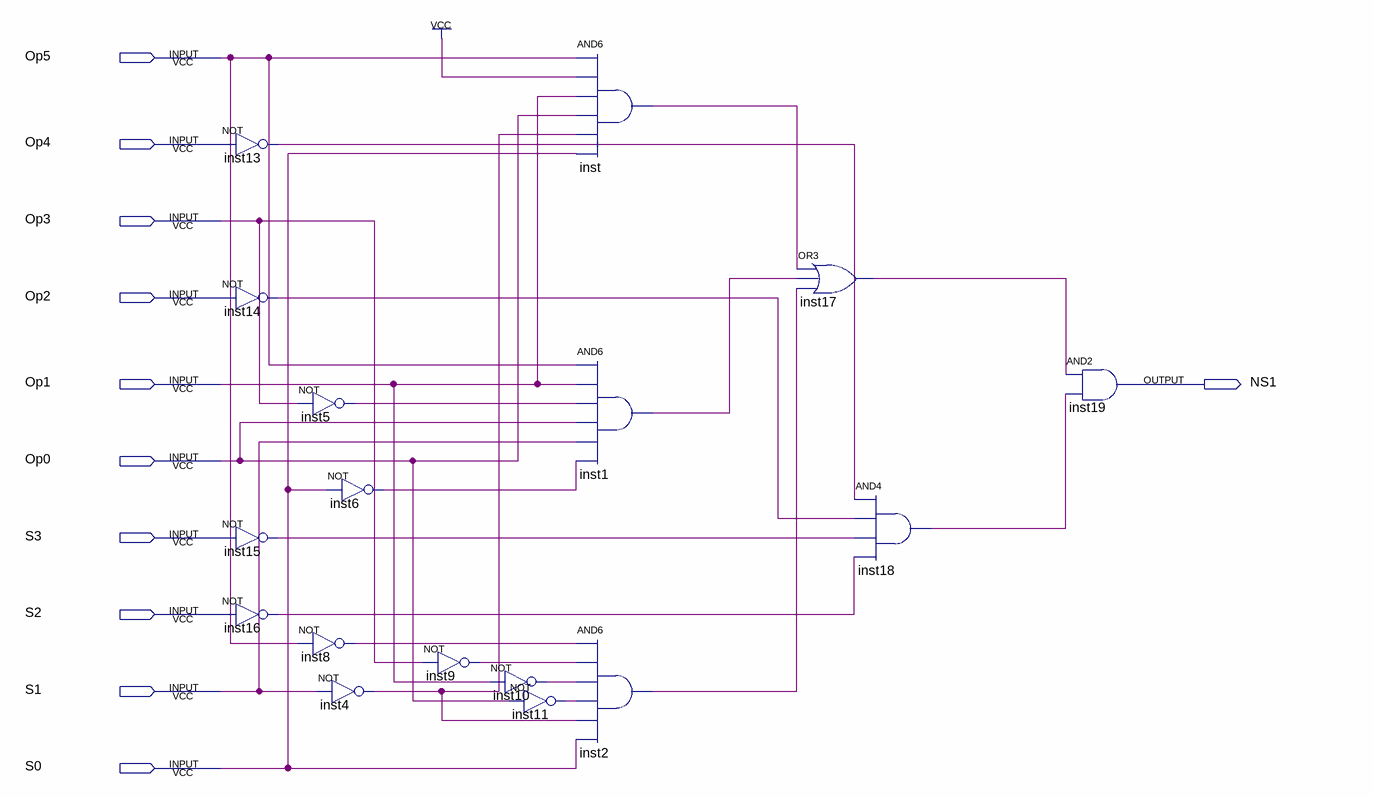
[diagram p0: schematic sheet]
// Quartus schematic NS1.bdf as structural Verilog: 17 symbols, 11 pins
module NS1 (
  input  Op5,
  input  Op4,
  input  Op3,
  input  Op2,
  input  Op1,
  input  Op0,
  input  S3,
  input  S2,
  input  S1,
  input  S0,
  output NS1
);

  wire inst1_out, inst2_out, inst4_out, inst5_out, inst6_out, inst8_out, inst9_out, inst10_out, inst11_out,
       inst13_out, inst14_out, inst15_out, inst16_out, inst17_out, inst18_out, inst_out;

  not inst13 (inst13_out, Op4);
  not inst14 (inst14_out, Op2);
  not inst15 (inst15_out, S3);
  not inst16 (inst16_out, S2);
  not inst5 (inst5_out, Op3);
  not inst8 (inst8_out, Op5);
  not inst6 (inst6_out, S0);
  not inst4 (inst4_out, S1);
  not inst9 (inst9_out, Op3);
  not inst10 (inst10_out, Op1);
  not inst11 (inst11_out, Op0);
  and inst (inst_out, Op5, 1'b1, Op1, Op0, inst4_out, S0);
  and inst1 (inst1_out, Op5, Op1, inst5_out, Op0, S1, inst6_out);
  and inst2 (inst2_out, inst8_out, inst9_out, inst10_out, inst11_out, inst4_out, S0);
  or inst17 (inst17_out, inst_out, inst1_out, inst2_out);
  and inst18 (inst18_out, inst13_out, inst14_out, inst15_out, inst16_out);
  and inst19 (NS1, inst17_out, inst18_out);
endmodule
